# EAGLE design optical interrupter V1 (EAGLE 9.4.2)
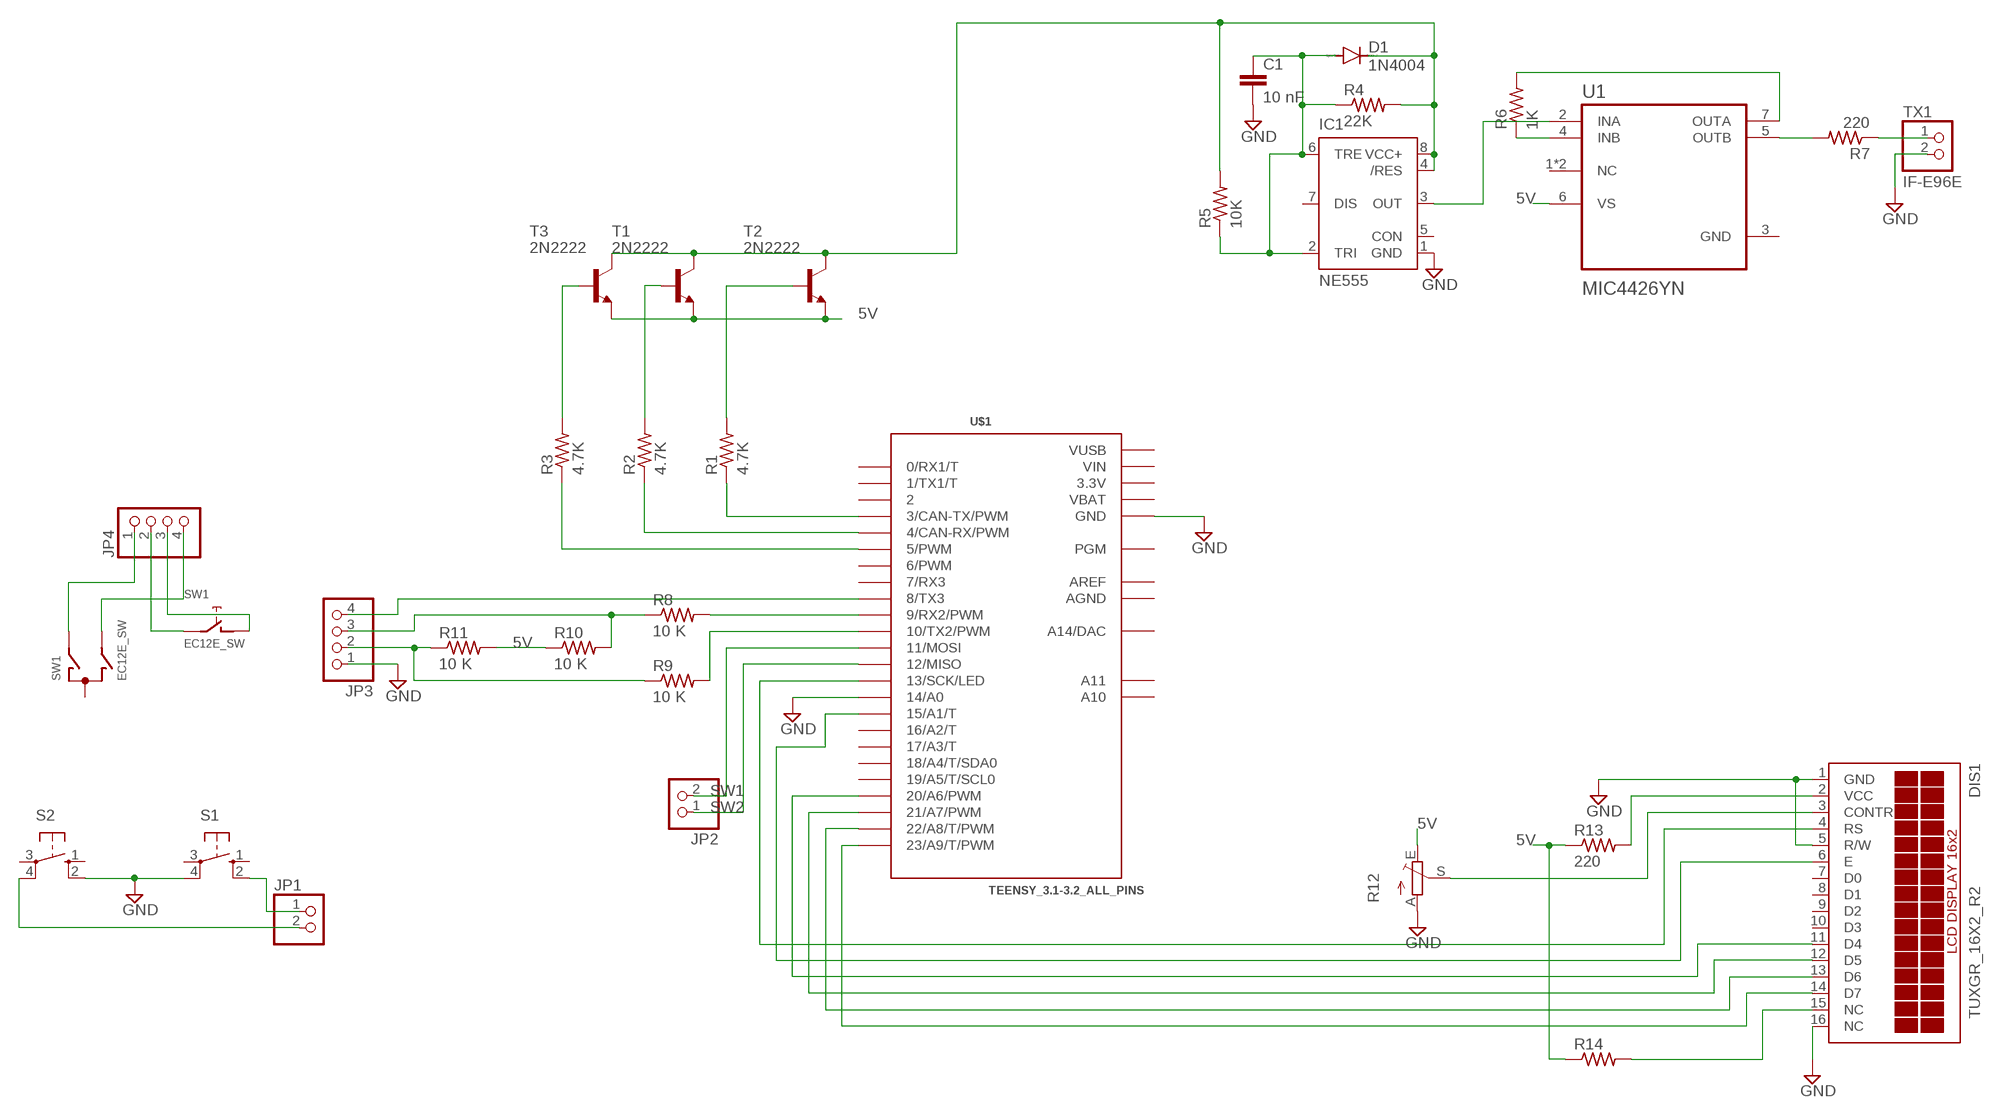
[diagram p0: schematic, sheet 1]

## Parts
C1  10 nF  C-EU050-024X044  [C050-024X044]
D1  1N4004  [DO41-10]
DIS1  TUXGR_16X2_R2  [TUXGR_16X2_R2]
IC1  NE555  [DIL-08]
JP1  PINHD-1X2  [1X02]
JP2  PINHD-1X2  [1X02]
JP3  PINHD-1X4  [1X04]
JP4  PINHD-1X4  [1X04]
R1  4.7K  R-US_0207/7  [0207/7]
R2  4.7K  R-US_0207/7  [0207/7]
R3  4.7K  R-US_0207/7  [0207/7]
R4  22K  R-US_0207/7  [0207/7]
R5  10K  R-US_0207/7  [0207/7]
R6  1K  R-US_0207/7  [0207/7]
R7  220  R-US_0207/7  [0207/7]
R8  10 K  R-US_0207/7  [0207/7]
R9  10 K  R-US_0207/7  [0207/7]
R10  10 K  R-US_0207/7  [0207/7]
R11  10 K  R-US_0207/7  [0207/7]
R12  TRIM_EU-B64W  [B64W]
R13  220  R-US_0207/7  [0207/7]
R14  R-US_0207/7  [0207/7]
S1  10-XX  [B3F-10XX]
S2  10-XX  [B3F-10XX]
SW1  EC12E_SW  [ALPS_EC12E_SW]
T1  2N2222  [TO92-EBC-OVAL]
T2  2N2222  [TO92-EBC-OVAL]
T3  2N2222  [TO92-EBC-OVAL]
TX1  IF-E96E  PINHD-1X2  [1X02]
U1  MIC4426YN  [DIP787W46P254L927H533Q8]
U$1  TEENSY_3.1-3.2_ALL_PINS  [TEENSY_3.0-3.2&LC_ALL_PINS]

## Nets
5V: R10.1 R11.2 R12.E R13.1 R14.1 T1.E T2.E T3.E U1.6(VS)
GND: C1.2 DIS1.1(GND) DIS1.5(R/W) DIS1.16(NC) IC1.1(GND) JP3.1 R12.A S1.4(P1) S2.2(S1) TX1.2 U$1.14/A0 U$1.GND U$1.GND1(GND)
N$1: R1.1 U$1.3(3/CAN-TX/PWM)
N$2: R2.1 U$1.4(4/CAN-RX/PWM)
N$3: R3.1 U$1.5(5/PWM)
N$4: R1.2 T2.B
N$5: R3.2 T3.B
N$6: R2.2 T1.B
N$7: D1.C IC1.4(/RES) IC1.8(VCC+) R4.2 R5.2 T1.C T2.C T3.C
N$8: C1.1 D1.A IC1.2(TRI) IC1.6(TRE) R4.1 R5.1
N$9: IC1.3(OUT) U1.2(INA)
N$10: R6.1 U1.4(INB)
N$11: R6.2 U1.7(OUTA)
N$12: R7.2 U1.5(OUTB)
N$13: R7.1 TX1.1
N$14: JP4.2 SW1.E
N$15: JP4.4 SW1.B
N$16: JP3.4 U$1.8(8/TX3)
N$17: R9.2 U$1.10(10/TX2/PWM)
N$18: R8.2 U$1.9(9/RX2/PWM)
N$19: JP3.3 R8.1 R10.2
N$20: JP3.2 R9.1 R11.1
N$21: DIS1.2(VCC) R13.2
N$22: DIS1.3(CONTR) R12.S
N$23: DIS1.4(RS) U$1.13(13/SCK/LED)
N$24: DIS1.6(E) U$1.15/A1(15/A1/T)
N$25: DIS1.11(D4) U$1.20/A6(20/A6/PWM)
N$26: DIS1.12(D5) U$1.21/A7(21/A7/PWM)
N$27: DIS1.13(D6) U$1.22/A8(22/A8/T/PWM)
N$28: DIS1.14(D7) U$1.23/A9(23/A9/T/PWM)
N$29: DIS1.15(NC) R14.2
N$30: JP4.1 SW1.A
N$31: JP4.3 SW1.D
N$32: JP1.1 S1.2(S1)
N$33: JP1.2 S2.4(P1)
SW1: JP2.2 U$1.11(11/MOSI)
SW2: JP2.1 U$1.12(12/MISO)
Unconnected: DIS1.7(D0) DIS1.8(D1) DIS1.9(D2) DIS1.10(D3) IC1.5(CON) IC1.7(DIS) S1.1(S) S1.3(P) S2.1(S) S2.3(P) SW1.C SW1.GND1(G) SW1.GND2(G) U1.1(NC) U1.8(NC) U$1.0(0/RX1/T) U$1.1(1/TX1/T) U$1.2 U$1.6(6/PWM) U$1.7(7/RX3) U$1.16/A2(16/A2/T) U$1.17/A3(17/A3/T) U$1.18/A4(18/A4/T/SDA0) U$1.19/A5(19/A5/T/SCL0) U$1.A10 U$1.A11 U$1.PGM U$1.RESET/DAC(A14/DAC)

## Power pins joined to a net without a drawn wire
3.3V: U$1.3.3V U$1.3.3V1(3.3V)
AGND: U$1.AGND
AREF: U$1.AREF
GND: U1.3(GND)
VBAT: U$1.VBAT
VIN: U$1.VIN
VUSB: U$1.VUSB

## Library data of the parts
C1 = rcl:C-EU: CAPACITOR, European symbol; SPICEPREFIX: C
D1 = diode:1N4004: DIODE general purpose rectifier, 1 A
DIS1 = display-lcd:TUXGR_16X2_R2: Tuxgraphics LCD display 16x2 characters reflective, without background light Source: tuxgr_12x2_r2.pdf; OC_FARNELL: unknown; OC_NEWARK: unknown
IC1 = st-microelectronics:NE555: General purpose bipolar Timer; MF: Arrow Electronics; MPN: NE555N; OC_FARNELL: 1467742; OC_NEWARK: 89K1486
JP1 JP2 TX1 = pinhead:PINHD-1X2: PIN HEADER
JP3 JP4 = pinhead:PINHD-1X4: PIN HEADER
R1-R11 R13 R14 = rcl:R-US_: RESISTOR, American symbol; SPICEPREFIX: R
R12 = pot:TRIM_EU-: POTENTIOMETER
S1 S2 = switch-omron:10-XX: OMRON SWITCH; MPN: B3F-1000; OC_FARNELL: 176432; OC_NEWARK: 36M3542
SW1 = switch-alps:EC12E_SW: ALPS rotary Encoder EC12E series with switch; MPN: EC12E2424407; OC_FARNELL: 1520813; OC_NEWARK: 74M1068
T1-T3 = adafruit:2N2222: NPN TRANSISTOR Big oval pads
U1 = MIC4426YN:MIC4426YN: None; DESCRIPTION: MIC4426 Series 6 Ohm 1.5 A Dual Peak Low-Side MOSFET Driver - PDIP-8; DIGI-KEY_PART_NUMBER: 576-1203-ND; DIGI-KEY_PURCHASE_URL: https://www.digikey.ca/product-detail/en/microchip-technology/MIC4426YN/576-1203-ND/771672?utm_source=snapeda&utm_medium=aggregator&utm_campaign=symbol; MF: Microchip; MP: MIC4426YN; PACKAGE: DIP-8 Microchip
U$1 = Teensy_3_and_LC_Series_Boards_v1.4:TEENSY_3.1-3.2_ALL_PINS: Footprint for Teensy 3.1 or 3.2 board using all through-holes, i.e. the entire perimeter plus the 4 through-holes inboard (A10,A11,AREF, VUSB)

## Board
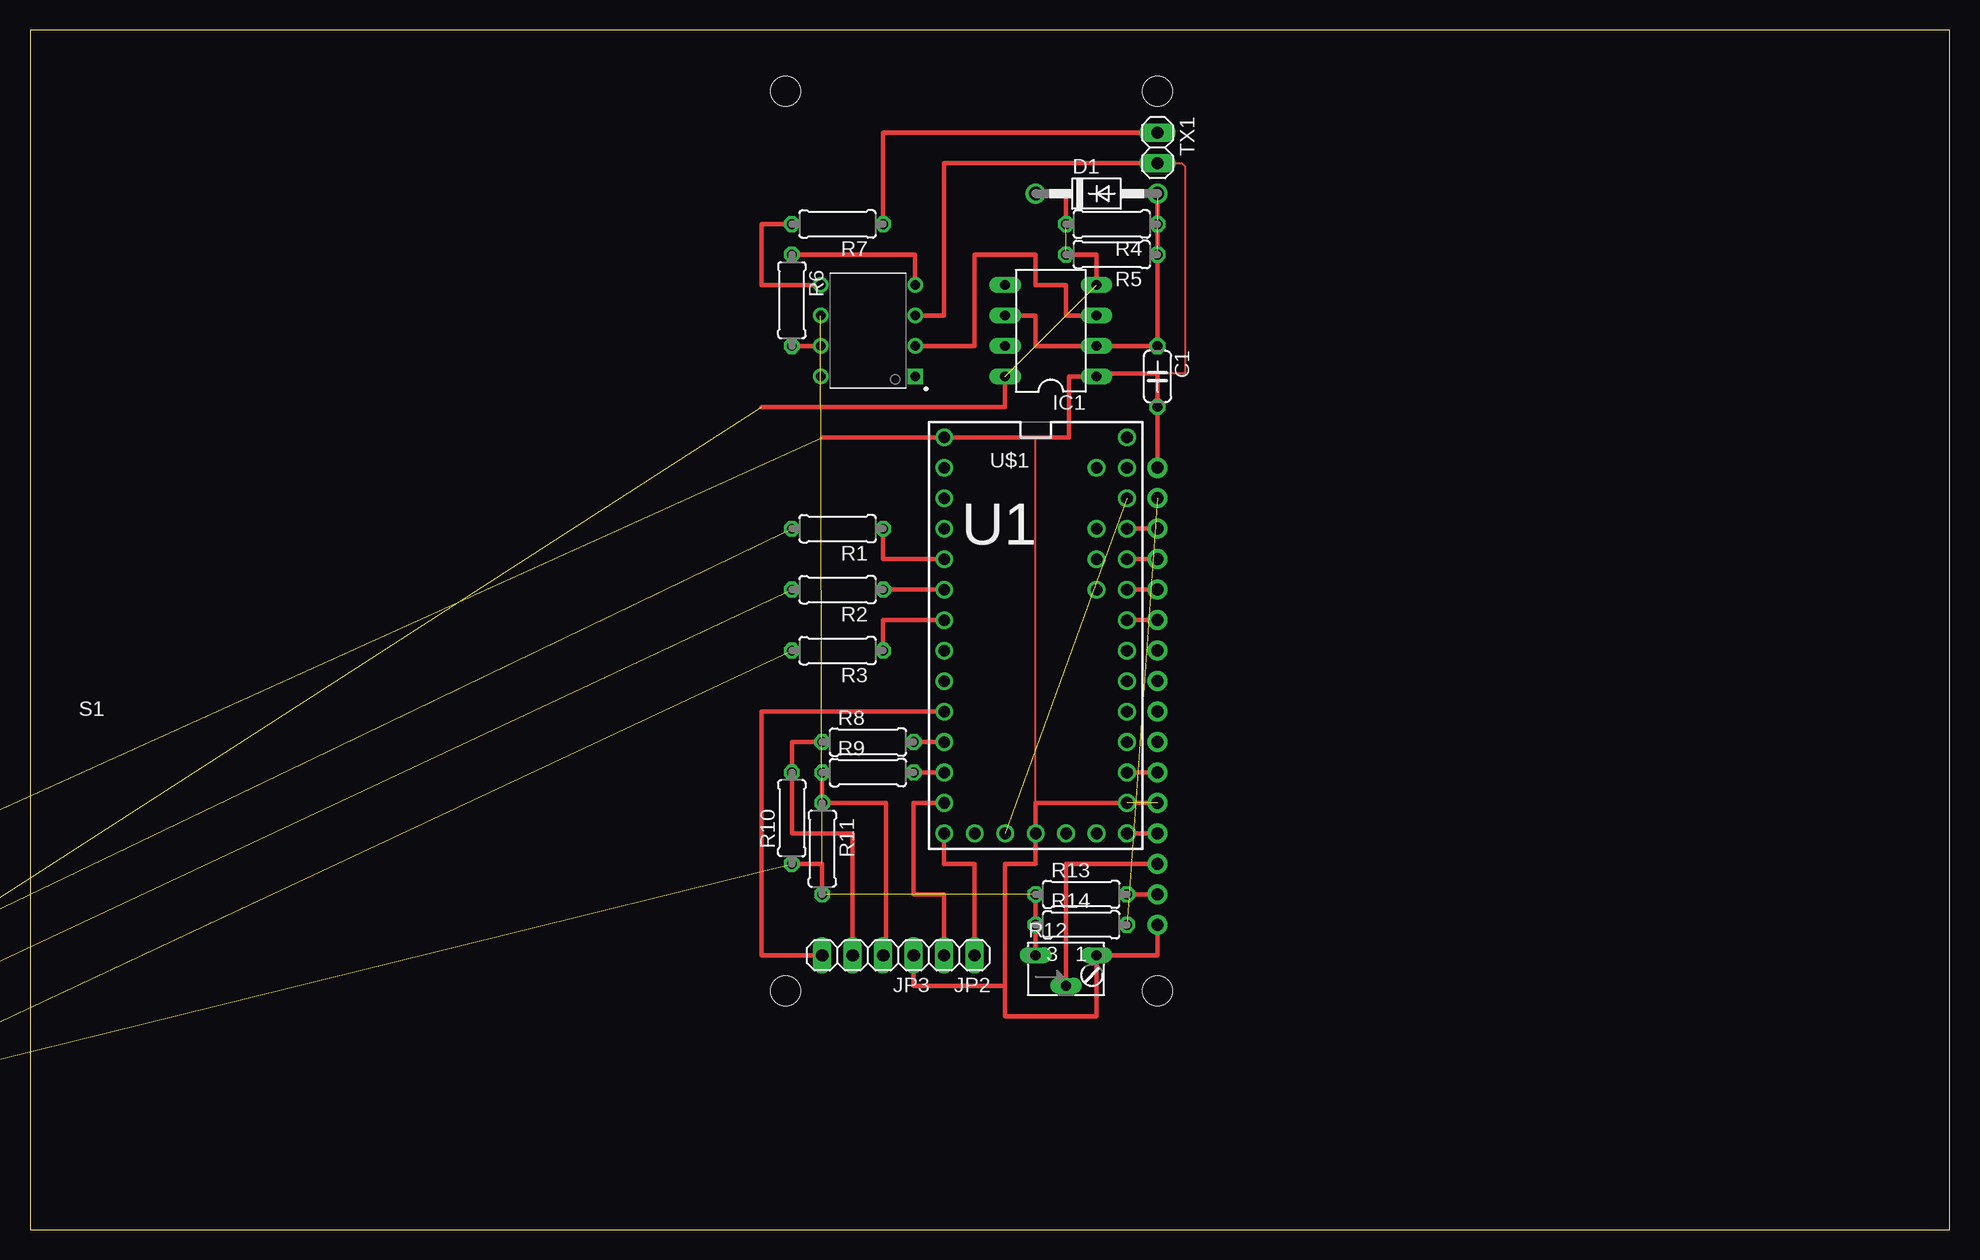
[diagram p1: board, top side]
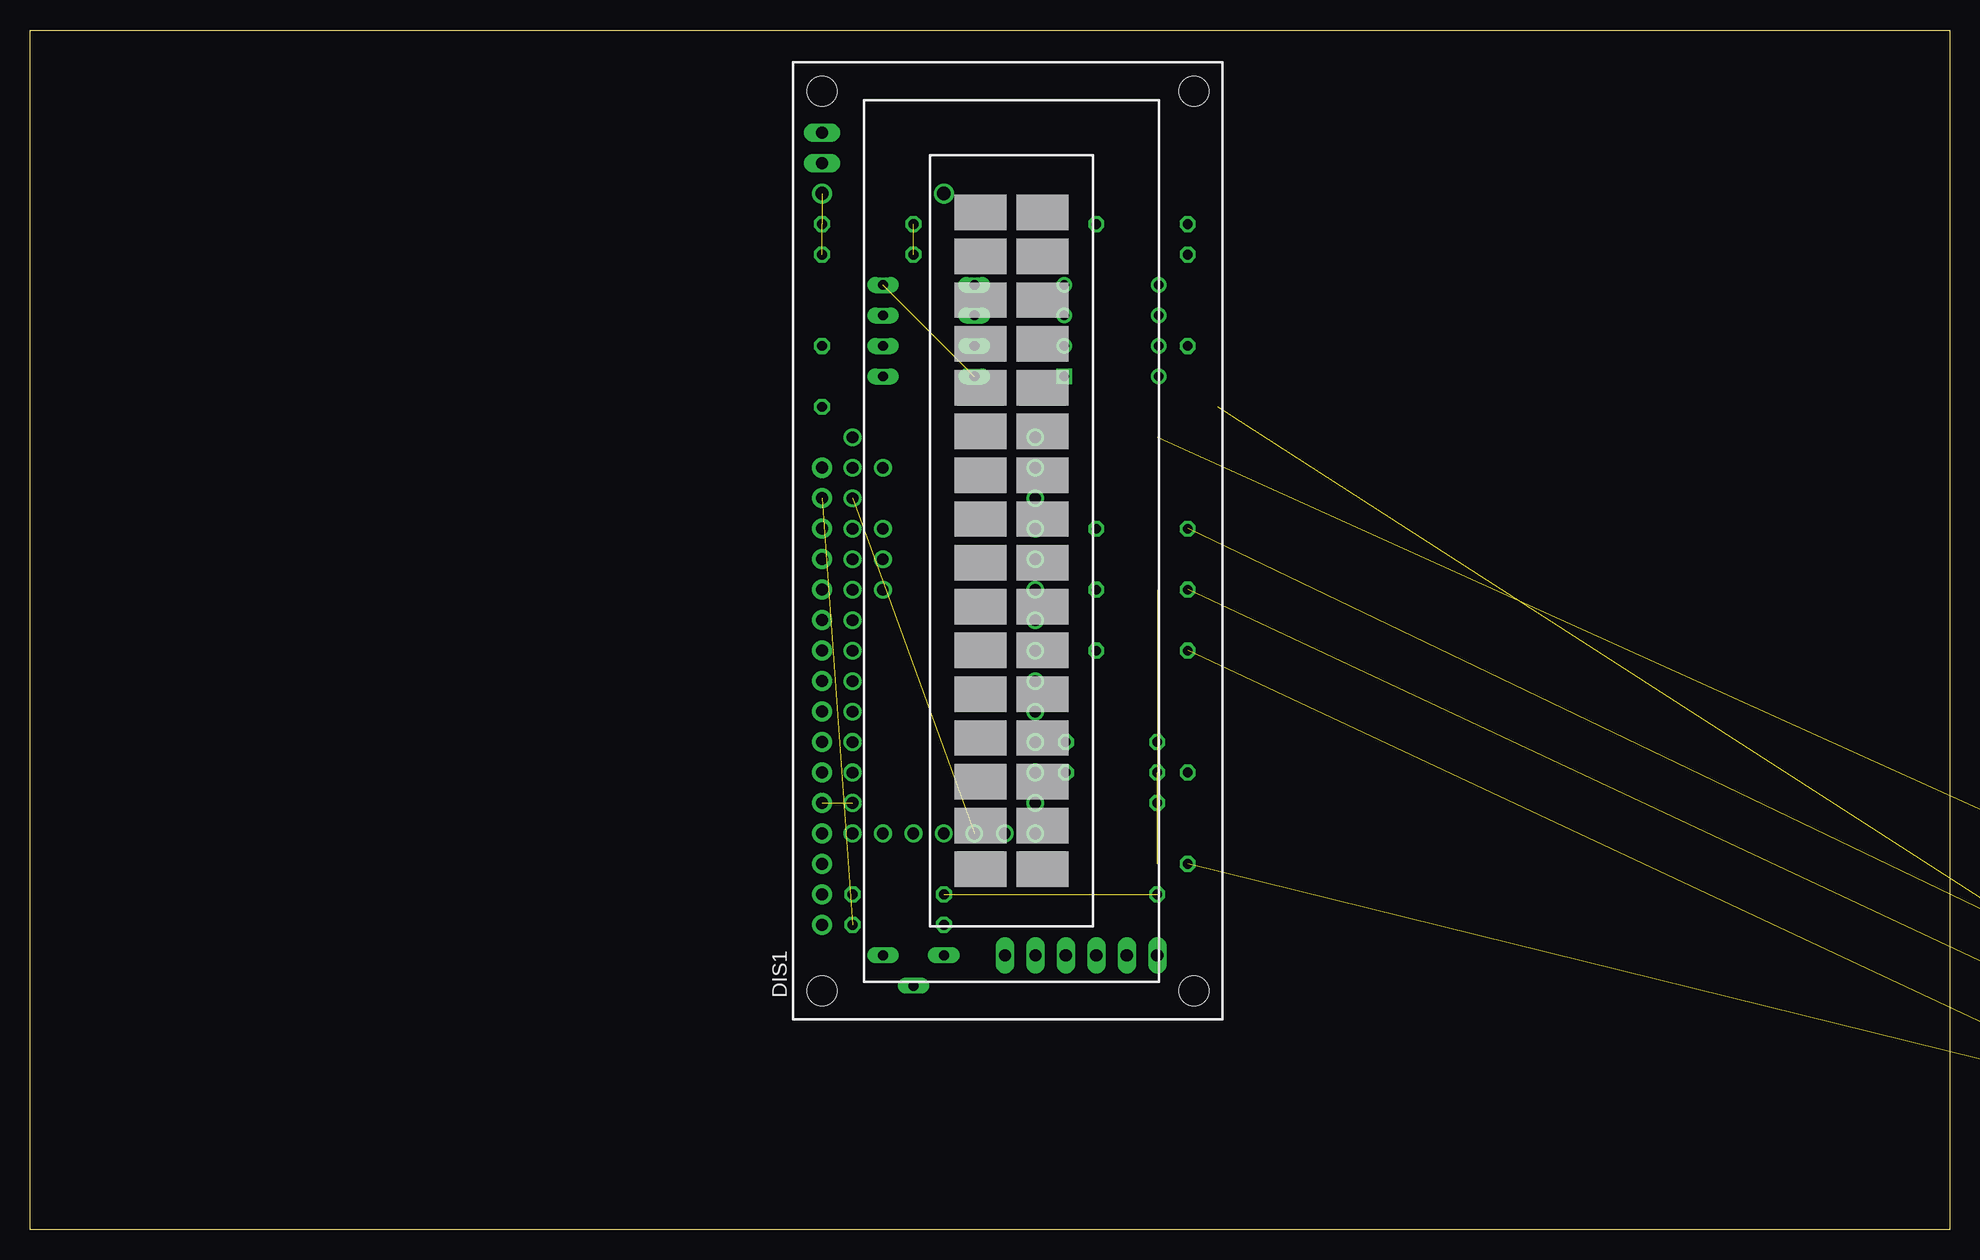
[diagram p2: board, bottom side, seen from below]

Size 160 x 100 mm. Coordinates in mm from the lower left corner, seen from the top.
Outline: 0,0 160,0 160,100 0,100 0,0
Copper layers (1*16): Top 0.035mm / dielectric 1.5mm / Bottom 0.035mm
Design rules "default": minimum track width 6mil, minimum drill 0.35mm, track to track 6mil, track to pad 6mil, pad to pad 6mil, via to via 6mil, smd to smd 6mil, copper to edge 40mil, drill to drill 6mil, minimum pad ring 10mil, minimum via ring 8mil, stop-mask expansion 4mil, vias tented up to drill 0mil, thermal gap 10mil

### Footprints (pad centres in the part's own frame; a part is rotated, then mirrored left to right if it is on the bottom)
C050-024X044 = drill 0.813 octagon: 1 -2.54,0; 2 2.54,0
DO41-10 = drill 1.118: A 5.08,0; C -5.08,0
TUXGR_16X2_R2 = drill 1 pad 1.676: 1 -32,15.5; 2 -29.46,15.5; 3 -26.92,15.5; 4 -24.38,15.5; 5 -21.84,15.5; 6 -19.3,15.5; 7 -16.76,15.5; 8 -14.22,15.5; 9 -11.68,15.5; 10 -9.14,15.5; 11 -6.6,15.5; 12 -4.06,15.5; 13 -1.52,15.5; 14 1.02,15.5; 15 3.56,15.5; 16 6.1,15.5 | hole 2.5: -37.5,-15.5; 37.5,-15.5; -37.5,15.5; 37.5,15.5
DIL-08 = drill 0.813 long: 1 -3.81,-3.81; 2 -1.27,-3.81; 3 1.27,-3.81; 4 3.81,-3.81; 5 3.81,3.81; 6 1.27,3.81; 7 -1.27,3.81; 8 -3.81,3.81
1X02 = drill 1.016 long: 1 -1.27,0; 2 1.27,0
1X04 = drill 1.016 long: 1 -3.81,0; 2 -1.27,0; 3 1.27,0; 4 3.81,0
0207/7 = drill 0.813 octagon: 1 -3.81,0; 2 3.81,0
B64W = drill 0.813 long: A 2.54,0; E -2.54,0; S 0,-2.54
B3F-10XX = drill 1.016 long: 1 -3.251,2.261; 2 3.251,2.261; 3 -3.251,-2.261; 4 3.251,-2.261
ALPS_EC12E_SW = drill 1 square: A -2.5,-7.5; B 2.5,-7.5; C 0,-7.5; D -2.5,7; E 2.5,7 | drill 2.2 square: GND1 -6.1,0; GND2 6.1,0
TO92-EBC-OVAL = drill 0.813 long: B 0,-1.27; C 2.54,-1.27; E -2.54,-1.27
DIP787W46P254L927H533Q8 = drill 0.8 square: 1 -3.935,3.81 | drill 0.8: 2 -3.935,1.27; 3 -3.935,-1.27; 4 -3.935,-3.81; 5 3.935,-3.81; 6 3.935,-1.27; 7 3.935,1.27; 8 3.935,3.81
TEENSY_3.0-3.2&LC_ALL_PINS = drill 0.965: 0 -7.62,13.97; 1 -7.62,11.43; 2 -7.62,8.89; 3 -7.62,6.35; 3.3V 7.62,11.43; 3.3V1 -2.54,-16.51; 4 -7.62,3.81; 5 -7.62,1.27; 6 -7.62,-1.27; 7 -7.62,-3.81; 8 -7.62,-6.35; 9 -7.62,-8.89; 10 -7.62,-11.43; 11 -7.62,-13.97; 12 -7.62,-16.51; 13 7.62,-16.51; 14/A0 7.62,-13.97; 15/A1 7.62,-11.43; 16/A2 7.62,-8.89; 17/A3 7.62,-6.35; 18/A4 7.62,-3.81; 19/A5 7.62,-1.27; 20/A6 7.62,1.27; 21/A7 7.62,3.81; 22/A8 7.62,6.35; 23/A9 7.62,8.89; A10 5.08,6.35; A11 5.08,3.81; AGND 7.62,13.97; AREF 5.08,8.89; GND -7.62,16.51; GND1 0,-16.51; PGM 2.54,-16.51; RESET/DAC 5.08,-16.51; VBAT -5.08,-16.51; VIN 7.62,16.51; VUSB 5.08,13.97

### Placement (x,y rotation side)
C1  93.98,71.12 270 top
D1  88.9,86.36 0 top
DIS1  78.49,57.4 90 bottom
IC1  85.09,74.93 90 top
JP1  -8.89,29.21 0 top  (outside the outline)
JP2  77.47,22.86 180 top
JP3  69.85,22.86 180 top
JP4  -28.96,42.42 0 top  (outside the outline)
R1  67.31,58.42 180 top
R2  67.31,53.34 180 top
R3  67.31,48.26 180 top
R4  90.17,83.82 180 top
R5  90.17,81.28 180 top
R6  63.5,77.47 270 top
R7  67.31,83.82 180 top
R8  69.85,40.64 0 top
R9  69.85,38.1 0 top
R10  63.5,34.29 90 top
R11  66.04,31.75 270 top
R12  86.36,22.86 0 top
R13  87.63,27.94 0 top
R14  87.63,25.4 0 top
S1  -15.75,32.77 0 top  (outside the outline)
S2  -16.51,24.38 0 top  (outside the outline)
SW1  -29.46,28.7 0 top  (outside the outline)
T1  -42.16,5.08 0 top  (outside the outline)
T2  -50.29,5.08 0 top  (outside the outline)
T3  -50.29,-3.81 0 top  (outside the outline)
TX1  93.98,90.17 270 top
U1  69.85,74.93 180 top
U$1  83.82,49.53 0 top

### Tracks (layer width: path | path; a pad name or v marks a point on that pad's centre or on a via)
3.3V  (1 unrouted)
5V  (5 unrouted)
  Top 0.381: R10.1 66.04,30.48 R11.2 | R13.1 R14.1 R12.E
GND  (3 unrouted)
  Top 0.152: 83.82,35.56 83.82,66.04 | TX1.2 96.01,88.9 96.27,88.65 96.27,71.37 93.98,71.37
  Top 0.381: 66.04,66.04 U$1.GND 83.82,66.04 86.61,66.04 86.61,71.12 IC1.1 88.9,71.37 93.98,71.37 C1.2 DIS1.16 | DIS1.5 83.82,35.56 U$1.GND1 83.82,30.48 81.28,30.48 81.28,20.32 | DIS1.1 93.99,22.86 R12.A 88.9,17.78 81.28,17.78 81.28,20.32 | TX1.2 76.2,88.9 76.2,76.2 U1.3 | JP3.1 73.66,20.32 81.28,20.32
N$1
  Top 0.381: R1.1 71.12,55.88 U$1.3
N$2
  Top 0.381: R2.1 U$1.4
N$3
  Top 0.381: R3.1 71.12,50.8 U$1.5
N$4  (1 unrouted)
N$5  (1 unrouted)
N$6  (1 unrouted)
N$7  (5 unrouted)
  Top 0.381: R4.2 86.36,86.36 D1.C | R5.2 88.9,81.28 IC1.4 | IC1.8 81.28,68.58 60.96,68.58
N$8  (2 unrouted)
  Top 0.381: D1.A C1.1 89.15,73.66 IC1.2 83.82,73.66 83.82,76.2 IC1.6
N$9
  Top 0.381: IC1.3 86.36,76.2 86.36,78.74 83.82,78.74 83.82,81.28 78.74,81.28 78.74,73.66 U1.2
N$10
  Top 0.381: R6.1 73.78,81.28 U1.4
N$11
  Top 0.381: U1.7 R6.2
N$12
  Top 0.381: R7.2 60.96,83.82 60.96,78.74 U1.5
N$13
  Top 0.381: R7.1 71.12,91.44 TX1.1
N$14  (1 unrouted)
N$15  (1 unrouted)
N$16
  Top 0.381: JP3.4 60.96,22.86 60.96,43.18 U$1.8
N$17
  Top 0.381: R9.2 U$1.10
N$18
  Top 0.381: R8.2 U$1.9
N$19
  Top 0.381: R8.1 63.5,40.64 R10.2 63.5,33.02 68.58,33.02 JP3.3
N$20
  Top 0.381: R9.1 R11.1 71.37,35.56 71.37,22.86 JP3.2
N$21
  Top 0.381: R13.2 DIS1.2
N$22
  Top 0.381: DIS1.3 86.36,30.48 R12.S
N$23
  Top 0.381: U$1.13 DIS1.4
N$24
  Top 0.381: U$1.15/A1 DIS1.6
N$25
  Top 0.381: DIS1.11 U$1.20/A6
N$26
  Top 0.381: DIS1.12 U$1.21/A7
N$27
  Top 0.381: DIS1.13 U$1.22/A8
N$28
  Top 0.381: DIS1.14 U$1.23/A9
N$29  (1 unrouted)
N$30  (1 unrouted)
N$31  (1 unrouted)
N$32  (1 unrouted)
N$33  (1 unrouted)
SW1
  Top 0.381: JP2.2 76.2,27.94 73.66,27.94 73.66,35.56 U$1.11
SW2
  Top 0.381: U$1.12 76.2,30.48 78.74,30.48 JP2.1